# Altium schematic sheet schema2.SchDoc
size A4
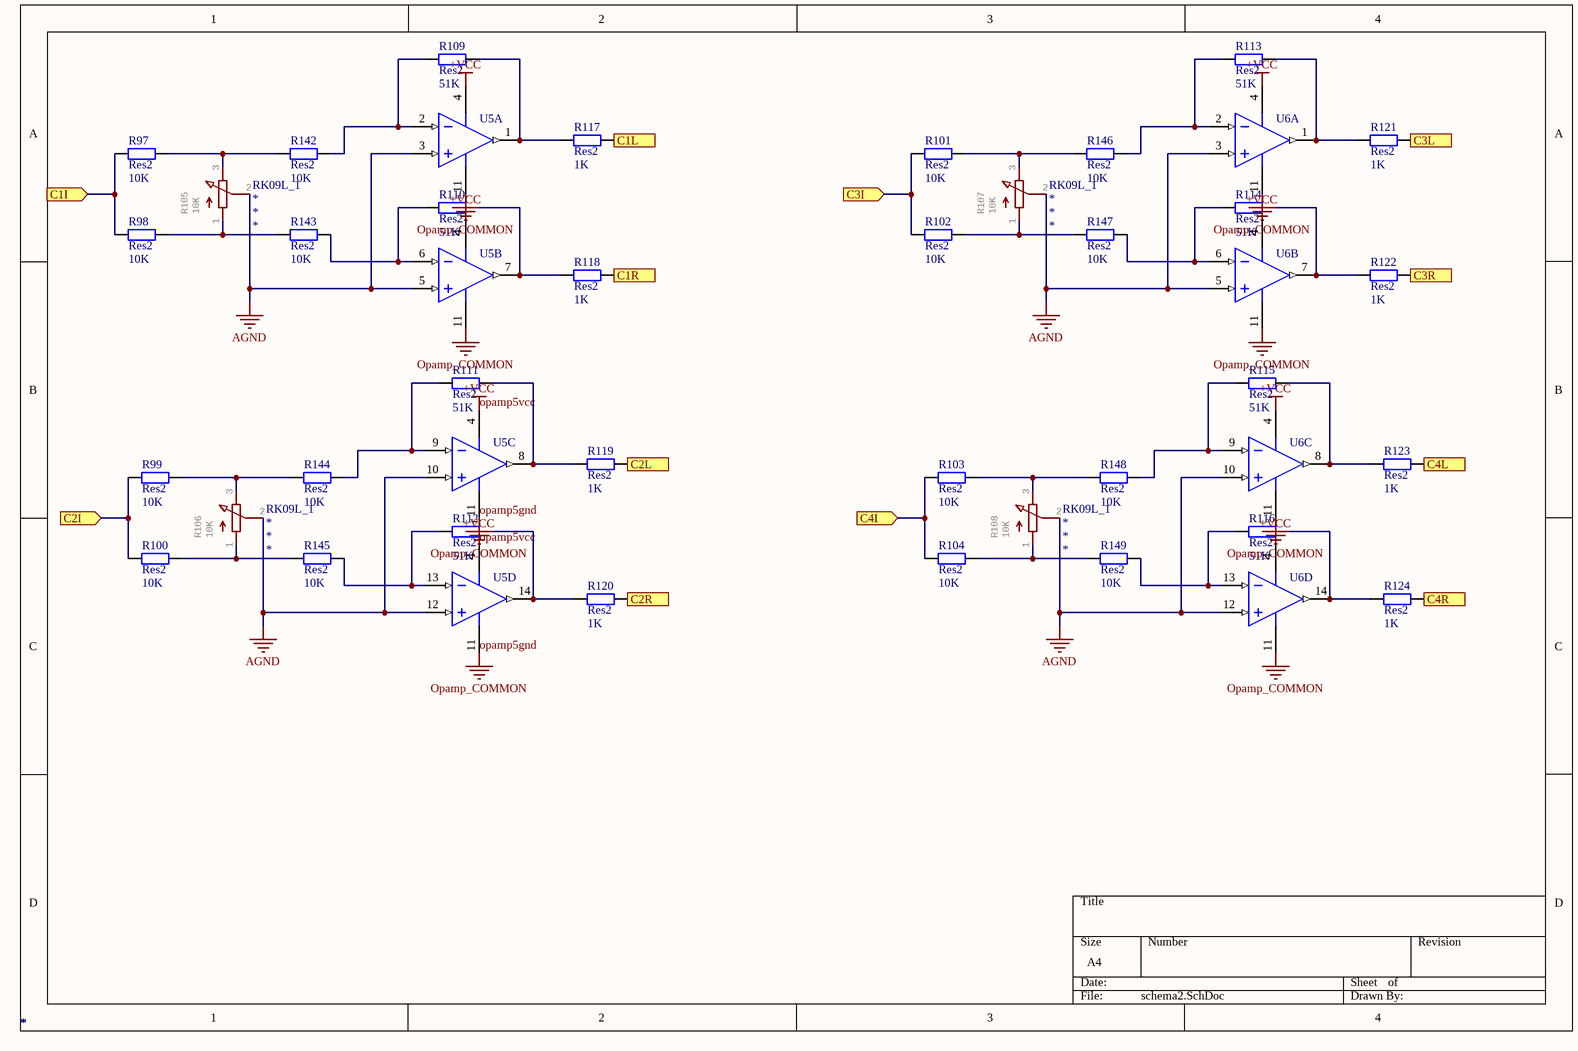
[diagram p0: schema2.SchDoc]

## Parts
R97  Res2  value 10K  [SMD_RESISTOR]
R98  Res2  value 10K  [SMD_RESISTOR]
R99  Res2  value 10K  [SMD_RESISTOR]
R100  Res2  value 10K  [SMD_RESISTOR]
R101  Res2  value 10K  [SMD_RESISTOR]
R102  Res2  value 10K  [SMD_RESISTOR]
R103  Res2  value 10K  [SMD_RESISTOR]
R104  Res2  value 10K  [SMD_RESISTOR]
R105  value 10K  [RK09L1140A65]
R106  value 10K  [RK09L1140A65]
R107  value 10K  [RK09L1140A65]
R108  value 10K  [RK09L1140A65]
R109  Res2  value 51K  [SMD_RESISTOR]
R110  Res2  value 51K  [SMD_RESISTOR]
R111  Res2  value 51K  [SMD_RESISTOR]
R112  Res2  value 51K  [SMD_RESISTOR]
R113  Res2  value 51K  [SMD_RESISTOR]
R114  Res2  value 51K  [SMD_RESISTOR]
R115  Res2  value 51K  [SMD_RESISTOR]
R116  Res2  value 51K  [SMD_RESISTOR]
R117  Res2  value 1K  [SMD_RESISTOR]
R118  Res2  value 1K  [SMD_RESISTOR]
R119  Res2  value 1K  [SMD_RESISTOR]
R120  Res2  value 1K  [SMD_RESISTOR]
R121  Res2  value 1K  [SMD_RESISTOR]
R122  Res2  value 1K  [SMD_RESISTOR]
R123  Res2  value 1K  [SMD_RESISTOR]
R124  Res2  value 1K  [SMD_RESISTOR]
R142  Res2  value 10K  [SMD_RESISTOR]
R143  Res2  value 10K  [SMD_RESISTOR]
R144  Res2  value 10K  [SMD_RESISTOR]
R145  Res2  value 10K  [SMD_RESISTOR]
R146  Res2  value 10K  [SMD_RESISTOR]
R147  Res2  value 10K  [SMD_RESISTOR]
R148  Res2  value 10K  [SMD_RESISTOR]
R149  Res2  value 10K  [SMD_RESISTOR]
U5  OPA1664AIDR  [OPA1664AIDR]  (value not drawn)  (parts A,B,C,D of 4)
U6  OPA1664AIDR  [OPA1664AIDR]  (value not drawn)  (parts A,B,C,D of 4)

## Ports
C1I (in), C1L (out), C1R (out), C2I (in), C2L (out), C2R (out), C3I (in), C3L (out), C3R (out), C4I (in), C4L (out), C4R (out)

## Nets
AGND: R105.2 R106.2 R107.2 R108.2 U5.3(IN_A+) U5.5(IN_B+) U5.10(IN_C+) U5.12(IN_D+) U6.3(IN_A+) U6.5(IN_B+) U6.10(IN_C+) U6.12(IN_D+)
opamp5gnd: U5.11(V-) U6.11(V-)  [also labelled Opamp_COMMON]
opamp5vcc: U5.4(V+) U6.4(V+)  [also labelled +VCC]
C1I: R97.1 R98.1 ; port C1I
C1L: R117.2 ; port C1L
C1R: R118.2 ; port C1R
C2I: R99.1 R100.1 ; port C2I
C2L: R119.2 ; port C2L
C2R: R120.2 ; port C2R
C3I: R101.1 R102.1 ; port C3I
C3L: R121.2 ; port C3L
C3R: R122.2 ; port C3R
C4I: R103.1 R104.1 ; port C4I
C4L: R123.2 ; port C4L
C4R: R124.2 ; port C4R
NetR97_2: R97.2 R105.3 R142.1
NetR98_2: R98.2 R105.1 R143.1
NetR99_2: R99.2 R106.3 R144.1
NetR100_2: R100.2 R106.1 R145.1
NetR101_2: R101.2 R107.3 R146.1
NetR102_2: R102.2 R107.1 R147.1
NetR103_2: R103.2 R108.3 R148.1
NetR104_2: R104.2 R108.1 R149.1
NetR109_1: R109.1 R142.2 U5.2(IN_A-)
NetR109_2: R109.2 R117.1 U5.1(OUT_A)
NetR110_1: R110.1 R143.2 U5.6(IN_B-)
NetR110_2: R110.2 R118.1 U5.7(OUT_B)
NetR111_1: R111.1 R144.2 U5.9(IN_C-)
NetR111_2: R111.2 R119.1 U5.8(OUT_C)
NetR112_1: R112.1 R145.2 U5.13(IN_D-)
NetR112_2: R112.2 R120.1 U5.14(OUT_D)
NetR113_1: R113.1 R146.2 U6.2(IN_A-)
NetR113_2: R113.2 R121.1 U6.1(OUT_A)
NetR114_1: R114.1 R147.2 U6.6(IN_B-)
NetR114_2: R114.2 R122.1 U6.7(OUT_B)
NetR115_1: R115.1 R148.2 U6.9(IN_C-)
NetR115_2: R115.2 R123.1 U6.8(OUT_C)
NetR116_1: R116.1 R149.2 U6.13(IN_D-)
NetR116_2: R116.2 R124.1 U6.14(OUT_D)

## Library data of the parts
R97-R104 R109-R124 R142-R149 = Res2: Resistor; Published: 8-Jun-2000; LatestRevisionDate: 17-Jul-2002; LatestRevisionNote: Re-released for DXP Platform.; PackageReference: AXIAL-0.4; Publisher: Altium Limited; PackageDescription: Axial Device, Thru-Hole; 2 Leads; 0.4 in Pin Spacing
R105-R108 = RK09L_1: GateName_1: G$1; SymbolName_1: POT_EU-; DeviceSetName: RK09L; LibraryName: SD_Pots
U5 U6 = CMP-0272-00211-3: Sound Plus Low-Power, Low-Noise and Distortion, Audio Operational Amplifier, 3 to 36 V, -40 to 85 degC, 14-pin SOIC (D14), Green (RoHS & no Sb/Br); Manufacturer: Texas Instruments; Iq per channel(Max)(mA): 1.5; IIB(Max)(pA): 1200000; Offset Drift(Typ)(uV/C): 2; Total Supply Voltage(Max)(+5V is 5, +/-5V is 10): 36; Rating: Catalog; Packing: LARGE T&R; Slew Rate(Typ)(V/us): 17; CMRR(Min)(dB): 106; Total Supply Voltage(Min)(+5V is 5, +/-5V is 10): 3; Sub Family: Audio Operational Amplifier, High Supply Voltage Amplifier (>=30V), Low Noise Amp (<=10nV/rtHz), Precision Amplifier; GBW(Typ)(MHz): 22; Number of Channels: 4; Code_JEDEC: MS-012; PartNumber: OPA1664AIDR; ComponentLink2Description: Datasheet; ComponentLink3URL: http://www.ti.com/lit/ml/mpds177g/mpds177g.pdf; PackageVersion: 4040047-5/M, 06/2011; ComponentLink1Description: Manufacturer URL; DatasheetVersion: SBOS489; Mounting Technology: Surface Mount; Vio (25C)(Max)(mV): 1.5; PackageReference: D0014A; ComponentLink1URL: http://www.ti.com/; ComponentLink2URL: http://www.ti.com/lit/ds/symlink/opa1664.pdf; Eco-Plan: Green (RoHS & no Sb/Br); PackageDescription: 14-Pin Plastic Small Outline, Body 8.65 x 3.9 mm, Pitch 1.27 mm; ComponentLink3Description: Package Specification